# Altium schematic sheet Peak.SchDoc
size A4
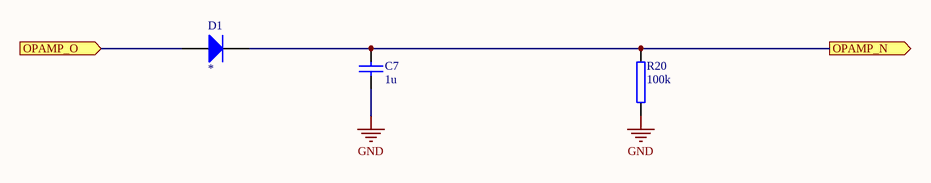
[diagram p0: Peak.SchDoc]

## Parts
C7  1u
D1  *
R20  100k  [AXIAL0.4]

## Ports
OPAMP_N (out), OPAMP_O (in)

## Nets
GND: C7.2 R20.1
OPAMP_N: C7.1 D1.2(K) R20.2 ; port OPAMP_N
OPAMP_O: D1.1(A) ; port OPAMP_O

## Library data of the parts
C7 = Cap: Capacitor; Value: *
D1 = Diode: Value: *
R20 = RES2